# Altium schematic sheet DRIVER.SchDoc
size A4; SheetNumber: 2; SheetTotal: 4
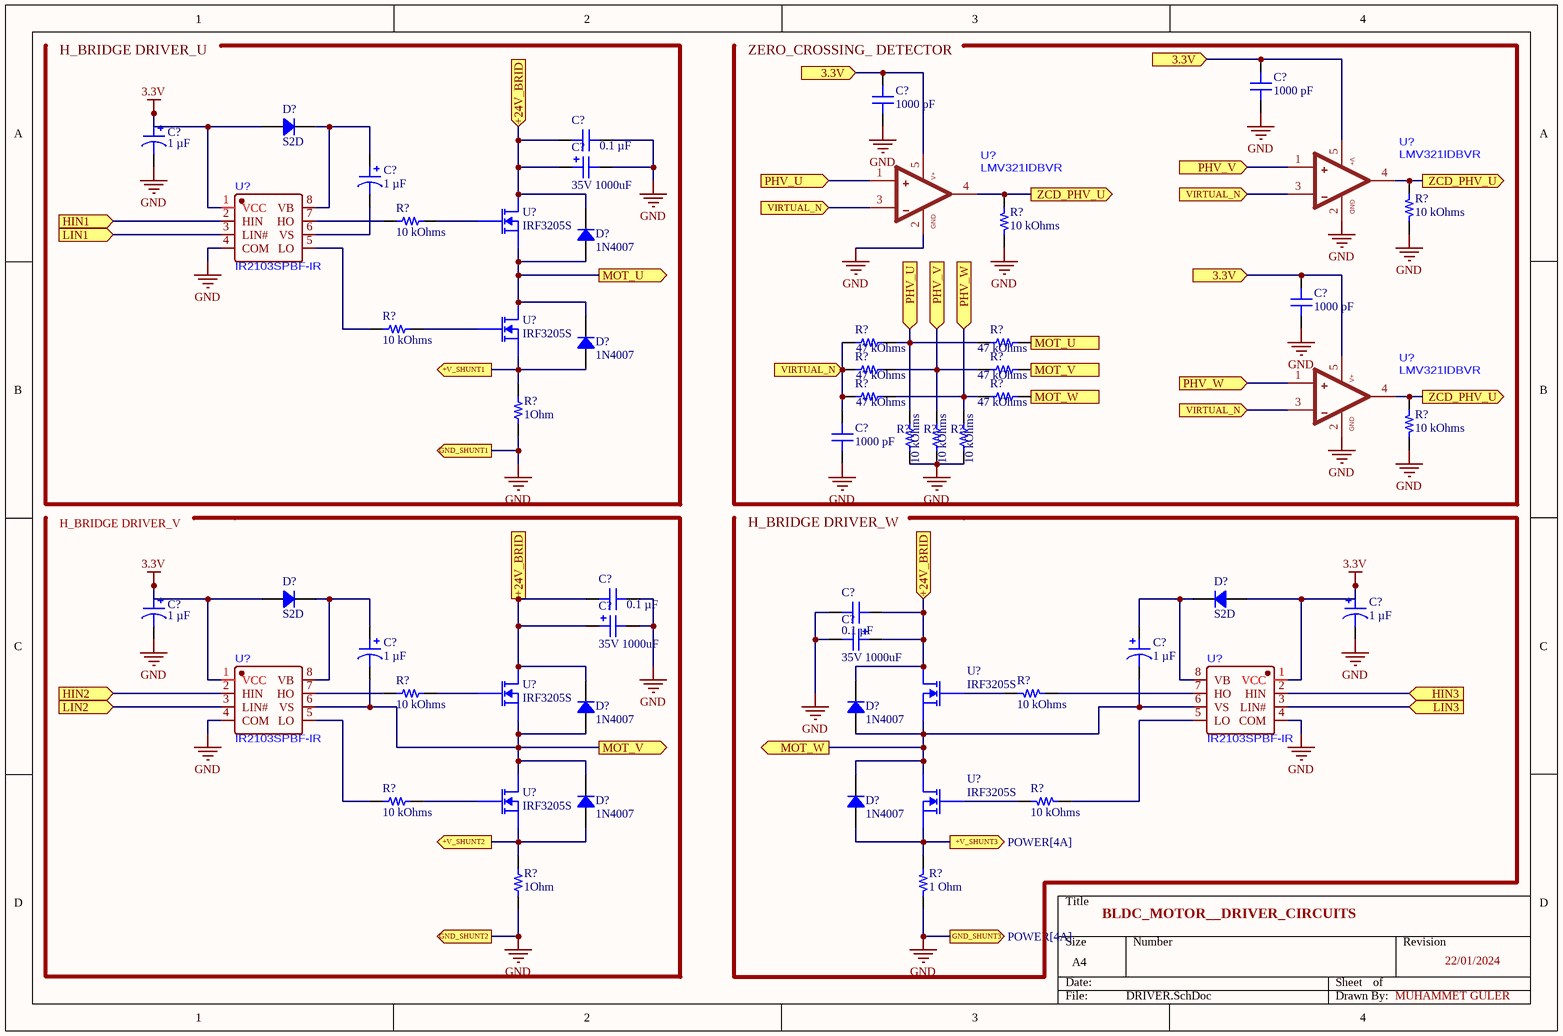
[diagram p0: DRIVER.SchDoc]

## Parts
(Parts that share a designator on the sheet are numbered #1, #2 ... from top to bottom, then left to right.)
C?#1  1000 pF  [CAP 1210_3225 - 1MM]
C?#2  1000 pF  [CAP 1210_3225 - 1MM]
C?#3  1 µF  [CAP ALSMD 4.3MM H5.4MM]
C?#4  0.1 µF  [CAP 1210_3225 - 1MM]
C?#5  35V 1000uF  [35V 1000uF]
C?#6  1 µF  [CAP ALSMD 4.3MM H5.4MM]
C?#7  1000 pF  [CAP 1210_3225 - 1MM]
C?#8  1000 pF  [CAP 1210_3225 - 1MM]
C?#9  0.1 µF  [CAP 1210_3225 - 1MM]
C?#10  1 µF  [CAP ALSMD 4.3MM H5.4MM]
C?#11  0.1 µF  [CAP 1210_3225 - 1MM]
C?#12  1 µF  [CAP ALSMD 4.3MM H5.4MM]
C?#13  35V 1000uF  [35V 1000uF]
C?#14  35V 1000uF  [35V 1000uF]
C?#15  1 µF  [CAP ALSMD 4.3MM H5.4MM]
C?#16  1 µF  [CAP ALSMD 4.3MM H5.4MM]
D?#1  S2D  [DO214AA SMB]
D?#2  1N4007  [DO214AA SMB]
D?#3  1N4007  [DO214AA SMB]
D?#4  S2D  [DO214AA SMB]
D?#5  S2D  [DO214AA SMB]
D?#6  1N4007  [DO214AA SMB]
D?#7  1N4007  [DO214AA SMB]
D?#8  1N4007  [DO214AA SMB]
D?#9  1N4007  [DO214AA SMB]
R?#1  10 kOhms  [RES 1210_3225]
R?#2  10 kOhms  [RES 1210_3225]
R?#3  10 kOhms  [RES 1210_3225]
R?#4  10 kOhms  [RES 1210_3225]
R?#5  47 kOhms  [RES 1210_3225]
R?#6  47 kOhms  [RES 1210_3225]
R?#7  47 kOhms  [RES 1210_3225]
R?#8  47 kOhms  [RES 1210_3225]
R?#9  47 kOhms  [RES 1210_3225]
R?#10  47 kOhms  [RES 1210_3225]
R?#11  1Ohm  [RES 1210_3225]
R?#12  10 kOhms  [RES 1210_3225]
R?#13  10 kOhms  [RES 1210_3225]
R?#14  10 kOhms  [RES 1210_3225]
R?#15  10 kOhms  [RES 1210_3225]
R?#16  10 kOhms  [RES 1210_3225]
R?#17  10 kOhms  [RES 1210_3225]
R?#18  10 kOhms  [RES 1210_3225]
R?#19  10 kOhms  [RES 1210_3225]
R?#20  1Ohm  [RES 1210_3225]
R?#21  1 Ohm  [RES 1210_3225]
U?#1  LMV321IDBVR  [SOT-23-5_LMV324ID]
U?#2  LMV321IDBVR  [SOT-23-5_LMV324ID]
U?#3  IRF3205S  [IRF4905]
U?#4  IR2103SPBF-IR  [SOIC-8_IR2103]
U?#5  IRF3205S  [IRF4905]
U?#6  LMV321IDBVR  [SOT-23-5_LMV324ID]
U?#7  IRF3205S  [IRF4905]
U?#8  IRF3205S  [IRF4905]
U?#9  IR2103SPBF-IR  [SOIC-8_IR2103]
U?#10  IR2103SPBF-IR  [SOIC-8_IR2103]
U?#11  IRF3205S  [IRF4905]
U?#12  IRF3205S  [IRF4905]

## Ports
3.3V (in, see DRIVER[3A], DRIVER[4B], MCU[1B], MCU[1C], MCU[1D], MCU[2A], MCU[2B], MCU[2C], MCU[2D], MCU[3A], MCU[3B], MCU[3D], MCU[4A], MCU[4C], POWER[2A], POWER[3A], POWER[3B], POWER[4A], PROTECTION[2D], PROTECTION[4A], PROTECTION[4B]), 3.3V (in, see DRIVER[3A], MCU[1B], MCU[1C], MCU[1D], MCU[2A], MCU[2B], MCU[2C], MCU[2D], MCU[3A], MCU[3B], MCU[3D], MCU[4A], MCU[4C], POWER[2A], POWER[3A], POWER[3B], POWER[4A], PROTECTION[2D], PROTECTION[4A], PROTECTION[4B]), +24V_BRID (in, see DRIVER[2A], DRIVER[2C], POWER[1A], POWER[1C], POWER[3C], POWER[4C]), +24V_BRID (in, see DRIVER[2A], DRIVER[3C], POWER[1A], POWER[1C], POWER[3C], POWER[4C]), +24V_BRID (in, see DRIVER[2C], DRIVER[3C], POWER[1A], POWER[1C], POWER[3C], POWER[4C]), +V_SHUNT1 (out, see POWER[3A]), +V_SHUNT2 (out, see POWER[3B]), +V_SHUNT3 (out, see POWER[4A]), GND_SHUNT1 (out, see POWER[3A]), GND_SHUNT2 (out, see POWER[3B]), GND_SHUNT3 (out, see POWER[4A]), HIN1 (in, see MCU[3B]), HIN2 (in, see MCU[3B]), HIN3 (in, see MCU[3B]), LIN1 (in, see MCU[3B]), LIN2 (in, see MCU[3A]), LIN3 (in, see MCU[3A]), MOT_U (in, see DRIVER[2B]), MOT_U (out, see DRIVER[3B]), MOT_V (in, see DRIVER[2C]), MOT_V (out, see DRIVER[3B]), MOT_W (in, see DRIVER[2C]), MOT_W (out, see DRIVER[3B]), PHV_U (in, see DRIVER[2A], MCU[2B], PROTECTION[3A]), PHV_U (in, see DRIVER[3B], MCU[2B], PROTECTION[3A]), PHV_V (in, see DRIVER[3B], MCU[2B], PROTECTION[3A]), PHV_V (in, see DRIVER[4A], MCU[2B], PROTECTION[3A]), PHV_W (in, see DRIVER[3B], MCU[2B], PROTECTION[3A]), PHV_W (in, see DRIVER[4B], MCU[2B], PROTECTION[3A]), VIRTUAL_N (in, see DRIVER[2A], DRIVER[2B], DRIVER[4A], MCU[2B], PROTECTION[3A]), VIRTUAL_N (in, see DRIVER[2A], DRIVER[2B], DRIVER[4B], MCU[2B], PROTECTION[3A]), VIRTUAL_N (in, see DRIVER[2A], DRIVER[4A], DRIVER[4B], MCU[2B], PROTECTION[3A]), VIRTUAL_N (in, see DRIVER[2B], DRIVER[4A], DRIVER[4B], MCU[2B], PROTECTION[3A]), ZCD_PHV_U (out, see DRIVER[3A], DRIVER[4A], MCU[2B]), ZCD_PHV_U (out, see DRIVER[3A], DRIVER[4B], MCU[2B]), ZCD_PHV_U (out, see DRIVER[4A], DRIVER[4B], MCU[2B])

## Nets
3.3V: C?#3.1 C?#10.1 C?#12.1 D?#1.1 D?#4.1 D?#5.1 U?#4.1(VCC) U?#9.1(VCC) U?#10.1(VCC)
GND: C?#1.2 C?#2.2 C?#3.2 C?#4.2 C?#5.2(out) C?#7.2 C?#8.2 C?#9.2 C?#10.2 C?#11.2 C?#12.2 C?#13.2(out) C?#14.2(out) R?#1.2 R?#3.2 R?#11.2 R?#12.2 R?#13.2 R?#14.2 R?#15.2 R?#20.2 R?#21.2 U?#1.2(GND) U?#2.2(GND) U?#4.4(COM) U?#6.2(GND) U?#9.4(COM) U?#10.4(COM) ; port GND_SHUNT1, port GND_SHUNT2, port GND_SHUNT3
3.3V: C?#1.1 C?#2.1 C?#7.1 U?#1.5(V+) U?#2.5(V+) U?#6.5(V+) ; port 3.3V  [a separate net that carries the same name]
+24V_BRID: C?#4.1 C?#5.1(in) C?#9.1 C?#11.1 C?#13.1(in) C?#14.1(in) D?#2.2 D?#6.2 D?#7.2 U?#3.2(D) U?#7.2(D) U?#8.2(D) ; port +24V_BRID
+V_SHUNT1: D?#3.1 R?#11.1 U?#5.3(S) ; port +V_SHUNT1
+V_SHUNT2: D?#8.1 R?#20.1 U?#11.3(S) ; port +V_SHUNT2
+V_SHUNT3: D?#9.1 R?#21.1 U?#12.3(S) ; port +V_SHUNT3
HIN1: U?#4.2(HIN) ; port HIN1
HIN2: U?#9.2(HIN) ; port HIN2
HIN3: U?#10.2(HIN) ; port HIN3
LIN1: U?#4.3(LIN#) ; port LIN1
LIN2: U?#9.3(LIN#) ; port LIN2
LIN3: U?#10.3(LIN#) ; port LIN3
MOT_U: D?#2.1 D?#3.2 R?#6.2 U?#3.3(S) U?#5.2(D) ; port MOT_U
MOT_V: C?#15.2 D?#6.1 D?#8.2 R?#8.2 U?#7.3(S) U?#9.6(VS) U?#11.2(D) ; port MOT_V
MOT_W: C?#16.2 D?#7.1 D?#9.2 R?#10.2 U?#8.3(S) U?#10.6(VS) U?#12.2(D) ; port MOT_W
PHV_U: R?#5.2 R?#6.1 R?#13.1 U?#2.1(+) ; port PHV_U
PHV_V: R?#7.2 R?#8.1 R?#14.1 U?#1.1(+) ; port PHV_V
PHV_W: R?#9.2 R?#10.1 R?#15.1 U?#6.1(+) ; port PHV_W
VIRTUAL_N: C?#8.1 R?#5.1 R?#7.1 R?#9.1 U?#1.3(-) U?#2.3(-) U?#6.3(-) ; port VIRTUAL_N
ZCD_PHV_U: R?#1.1 R?#3.1 R?#12.1 U?#1.4(OUT) U?#2.4(OUT) U?#6.4(OUT) ; port ZCD_PHV_U
NetC?#6_1: C?#6.1 D?#1.2 U?#4.8(VB)
NetC?#6_2: C?#6.2 U?#4.6(VS)
NetC?#15_1: C?#15.1 D?#4.2 U?#9.8(VB)
NetC?#16_1: C?#16.1 D?#5.2 U?#10.8(VB)
NetR?#2_1: R?#2.1 U?#4.7(HO)
NetR?#2_2: R?#2.2 U?#3.1(G)
NetR?#4_1: R?#4.1 U?#4.5(LO)
NetR?#4_2: R?#4.2 U?#5.1(G)
NetR?#16_1: R?#16.1 U?#9.7(HO)
NetR?#16_2: R?#16.2 U?#7.1(G)
NetR?#17_1: R?#17.1 U?#10.7(HO)
NetR?#17_2: R?#17.2 U?#8.1(G)
NetR?#18_1: R?#18.1 U?#9.5(LO)
NetR?#18_2: R?#18.2 U?#11.1(G)
NetR?#19_1: R?#19.1 U?#10.5(LO)
NetR?#19_2: R?#19.2 U?#12.1(G)

## Notes on the sheet
- H_BRIDGE DRIVER_U
- (near C?#2) ZERO_CROSSING_ DETECTOR
- H_BRIDGE DRIVER_V
- H_BRIDGE DRIVER_W
- BLDC_MOTOR__DRIVER_CIRCUITS
- 22/01/2024
- MUHAMMET GÜLER

## Library data of the parts
C?#1 C?#2 C?#7 C?#8 = C1210C102FDGACAUTO: CAP CER 1210 1NF 1000V C0G 1%; manufacturer: KEMET; Temperature Coefficient: C0G, NP0; Voltage - Rated: 1000V (1kV); Part Number: C1210C102FDGACAUTO; Value: 1000 pF; Applications: Automotive; Capacitance: 1000 pF; componentlink1description: Datasheet; componentlink1url: https://api.kemet.com/component-edge/download/datasheet/C1210C102FDGACAUTO.pdf; componentlink2description: DigiKey Link; componentlink2url: https://www.digikey.com/en/products/detail/kemet/C1210C102FDGACAUTO/8109920; Device Package: 1210 (3225 Metric); Features: Low ESL, High Voltage; lastupdated: 17.01.2024 20:42:51; Lifecycle Status: Active; Minimum Order: 1; Mounting Type: Surface Mount, MLCC; Operating Temperature: -55°C ~ 125°C; Package / Case: 1210 (3225 Metric); packaging: TapeAndReel; partid: 26118; Part Status: Active; price: 0.74; Ratings: AEC-Q200; series: SMD Auto C0G HV; Size / Dimension: 0.126" L x 0.098" W (3.20mm x 2.50mm); Supplier 1: DigiKey; Supplier Part Number 1: 399-16739-1-ND; Thickness (Max): 0.075" (1.90mm); Tolerance: ±1%
C?#3 C?#6 C?#10 C?#12 C?#15 C?#16 = EEE-1HA010NR: CAP ALUM 1UF 20% 50V SMD; manufacturer: Panasonic Electronic Components; Lifetime @ Temp.: 2000 Hrs @ 85°C; Polarization: Bi-Polar; Ripple Current @ High Frequency: 17 mA @ 10 kHz; Ripple Current @ Low Frequency: 10 mA @ 120 Hz; Surface Mount Land Size: 0.169" L x 0.169" W (4.30mm x 4.30mm); Part Number: EEE-1HA010NR; Applications: Automotive; Capacitance: 1 µF; componentlink1description: Datasheet; componentlink1url: //media.digikey.com/pdf/Data%20Sheets/Panasonic%20Electronic%20Components/S_Series,Type_V_Rev2018.pdf; componentlink2description: DigiKey Link; componentlink2url: https://www.digikey.com/en/products/detail/panasonic-electronic-components/EEE-1HA010NR/946216; Device Package: Radial, Can - SMD; Height - Seated (Max): 0.213" (5.40mm); lastupdated: 14.01.2024 21:24:17; Lifecycle Status: Active; Minimum Order: 1; Mounting Type: Surface Mount; Operating Temperature: -40°C ~ 85°C; Package / Case: Radial, Can - SMD; packaging: TapeAndReel; partid: 7035; Part Status: Active; price: 0.07; Ratings: AEC-Q200; series: S; Size / Dimension: 0.157" Dia (4.00mm); Supplier 1: DigiKey; Supplier Part Number 1: PCE4301CT-ND; Tolerance: ±20%; value: 1 µF; Voltage - Rated: 50 V
C?#4 C?#9 C?#11 = CAN13X104KARAC7800: CAP CER 1210 0.1UF 250VAC X7R; manufacturer: KEMET; Tolerance: ±10%; Part Number: CAN13X104KARAC7800; Value: 0.1 µF; Applications: Boardflex Sensitive; Capacitance: 0.1 µF; componentlink1description: Datasheet; componentlink1url: //media.digikey.com/pdf/Data%20Sheets/Kemet%20PDFs/CAN13X104KARACTU_Spec.pdf; componentlink2description: DigiKey Link; componentlink2url: https://www.digikey.com/en/products/detail/kemet/CAN13X104KARAC7800/9962480; Device Package: 1210 (3225 Metric); Features: Soft Termination; lastupdated: 14.01.2024 20:41:00; Lifecycle Status: Active; Minimum Order: 1; Mounting Type: Surface Mount, MLCC; Operating Temperature: -55°C ~ 125°C; Package / Case: 1210 (3225 Metric); packaging: TapeAndReel; partid: 23615; Part Status: Active; price: 0.37; series: CAN SMD Indust X7R; Size / Dimension: 0.130" L x 0.102" W (3.30mm x 2.60mm); Supplier 1: DigiKey; Supplier Part Number 1: 399-20611-1-ND; Temperature Coefficient: X7R; Thickness (Max): 0.110" (2.80mm); Voltage - Rated: 250VAC
D?#1 D?#4 D?#5 = S2D: DIODE GEN PURP 200V 2A SMB; Manufacturer: ON Semiconductor; Capacitance @ Vr, F: 30pF @ 4V, 1MHz; Current - Reverse Leakage @ Vr: 1µA @ 200V; Diode Type: Standard; Reverse Recovery Time (trr): 2µs; Speed: Standard Recovery >500ns, > 200mA (Io); Voltage - Forward (Vf) (Max) @ If: 1.15V @ 2A; Part Number: S2D; ComponentLink1Description: Datasheet; ComponentLink1URL: https://www.onsemi.com/pub/Collateral/S2M-D.pdf; ComponentLink2Description: DigiKey Link; ComponentLink2URL: http://digikey.com/product-detail/en/on-semiconductor/S2D/S2DFSCT-ND/4744685; Current - Average Rectified (Io): 2A; LastUpdated: 14.01.2024 21:25:24; Lifecycle Status: Active; Minimum Order: 1; Mounting Type: Surface Mount; Operating Temperature - Junction: -65°C ~ 150°C; Package / Case: DO-214AA, SMB; Packaging: TapeAndReel; PartId: 25; Part Status: Active; Price: 0.08; Series: -; Supplier 1: DigiKey; Supplier Part Number 1: S2DFSCT-ND; Supplier Device Package: SMB (DO-214AA); Voltage - DC Reverse (Vr) (Max): 200V
D?#2 D?#3 D?#6-D?#9 = RS1AB-13-F: DIODE GEN PURP 50V 1A SMB; Manufacturer: Diodes Incorporated; Capacitance @ Vr, F: 15pF @ 4V, 1MHz; Current - Reverse Leakage @ Vr: 5 µA @ 50 V; Diode Type: Standard; Reverse Recovery Time (trr): 150 ns; Speed: Fast Recovery =< 500ns, > 200mA (Io); Voltage - Forward (Vf) (Max) @ If: 1.3 V @ 1 A; Part Number: RS1AB-13-F; ComponentLink1Description: Datasheet; ComponentLink1URL: https://www.diodes.com/assets/Datasheets/ds15002.pdf; ComponentLink2Description: DigiKey Link; ComponentLink2URL: https://www.digikey.com/en/products/detail/diodes-incorporated/RS1AB-13-F/814456; Current - Average Rectified (Io): 1A; LastUpdated: 15.01.2024 21:24:42; Lifecycle Status: Active; Minimum Order: 1; Mounting Type: Surface Mount; Operating Temperature - Junction: -65°C ~ 150°C; Package / Case: DO-214AA, SMB; Packaging: TapeAndReel; PartId: 27; Part Status: Active; Price: 0.06; Series: -; Supplier 1: DigiKey; Supplier Part Number 1: RS1AB-FDICT-ND; Supplier Device Package: SMB; Voltage - DC Reverse (Vr) (Max): 50 V
R?#1-R?#4 R?#12-R?#19 = RMCF1210FT10K0: RES 10K OHM 1% 1/2W 1210; Manufacturer: Stackpole Electronics Inc; Power (Watts): 0.5W, 1/2W; Temperature Coefficient: ±100ppm/°C; Part Number: RMCF1210FT10K0; ComponentLink1Description: Datasheet; ComponentLink1URL: https://www.seielect.com/catalog/sei-rmcf_rmcp.pdf; ComponentLink2Description: DigiKey Link; ComponentLink2URL: https://www.digikey.com/en/products/detail/stackpole-electronics-inc/RMCF1210FT10K0/1758528; Composition: Thick Film; Device Package: 1210 (3225 Metric); Features: Automotive AEC-Q200; Height - Seated (Max): 0.028" (0.70mm); Lifecycle Status: Active; Minimum Order: 1; Number of Terminations: 2; Operating Temperature: -55°C ~ 155°C; Package / Case: 1210 (3225 Metric); Packaging: TapeAndReel; Part Status: Active; Price: 0.01; Ratings: AEC-Q200; Resistance: 10 kOhms; Series: RMCF; Size / Dimension: 0.126" L x 0.098" W (3.20mm x 2.50mm); Supplier 1: DigiKey; Supplier Part Number 1: RMCF1210FT10K0CT-ND; Supplier Device Package: 1210; Tolerance: ±1%; Value: 10 kOhms
  R?#1 R?#3 R?#12-R?#15: LastUpdated: 16.01.2024 21:51:52
  R?#2 R?#4 R?#16-R?#19: LastUpdated: 14.01.2024 21:48:20
R?#5-R?#10 = CRGCQ1210F47K: RES 47K OHM 1% 1/2W 1210; Manufacturer: TE Connectivity Passive Product; Power (Watts): 0.5W, 1/2W; Temperature Coefficient: ±100ppm/°C; Part Number: CRGCQ1210F47K; ComponentLink1Description: Datasheet; ComponentLink1URL: https://www.te.com/commerce/DocumentDelivery/DDEController?Action=srchrtrv&DocNm=1773204-3&DocType=DS&DocLang=English; ComponentLink2Description: DigiKey Link; ComponentLink2URL: https://www.digikey.com/en/products/detail/te-connectivity-passive-product/CRGCQ1210F47K/8576493; Composition: Thick Film; Device Package: 1210 (3225 Metric); Features: Automotive AEC-Q200, Moisture Resistant; Height - Seated (Max): 0.026" (0.65mm); LastUpdated: 16.01.2024 21:51:51; Lifecycle Status: Active; Minimum Order: 1; Number of Terminations: 2; Operating Temperature: -55°C ~ 155°C; Package / Case: 1210 (3225 Metric); Packaging: TapeAndReel; Part Status: Active; Price: 0.03; Ratings: AEC-Q200; Resistance: 47 kOhms; Series: CRGCQ; Size / Dimension: 0.122" L x 0.102" W (3.10mm x 2.60mm); Supplier 1: DigiKey; Supplier Part Number 1: A129891CT-ND; Supplier Device Package: 1210; Tolerance: ±1%; Value: 47 kOhms
R?#11 R?#20 R?#21 = RMCF1210FT1K40: RES 1.4K OHM 1% 1/2W 1210; Manufacturer: Stackpole Electronics Inc; Power (Watts): 0.5W, 1/2W; Resistance: 1.4 kOhms; Temperature Coefficient: ±100ppm/°C; Value: 1.4 kOhms; Part Number: RMCF1210FT1K40; ComponentLink1Description: Datasheet; ComponentLink1URL: https://www.seielect.com/catalog/sei-rmcf_rmcp.pdf; ComponentLink2Description: DigiKey Link; ComponentLink2URL: https://www.digikey.com/en/products/detail/stackpole-electronics-inc/RMCF1210FT1K40/1715350; Composition: Thick Film; Device Package: 1210 (3225 Metric); Features: Automotive AEC-Q200; Height - Seated (Max): 0.028" (0.70mm); LastUpdated: 13.01.2024 21:51:14; Lifecycle Status: Active; Minimum Order: 1; Number of Terminations: 2; Operating Temperature: -55°C ~ 155°C; Package / Case: 1210 (3225 Metric); Packaging: TapeAndReel; Part Status: Active; Price: 0.01; Ratings: AEC-Q200; Series: RMCF; Size / Dimension: 0.126" L x 0.098" W (3.20mm x 2.50mm); Supplier 1: DigiKey; Supplier Part Number 1: 738-RMCF1210FT1K40CT-ND; Supplier Device Package: 1210; Tolerance: ±1%